# EAGLE schematic ESP8266MDL (EAGLE 7.7.0)
3v3 to TTL interfaceboard for HC-04/05/06 bluetoothmodule Dipswitch is provided for manual setting AT-mode to programming module Powersupply led and State led are added for easy monitoring
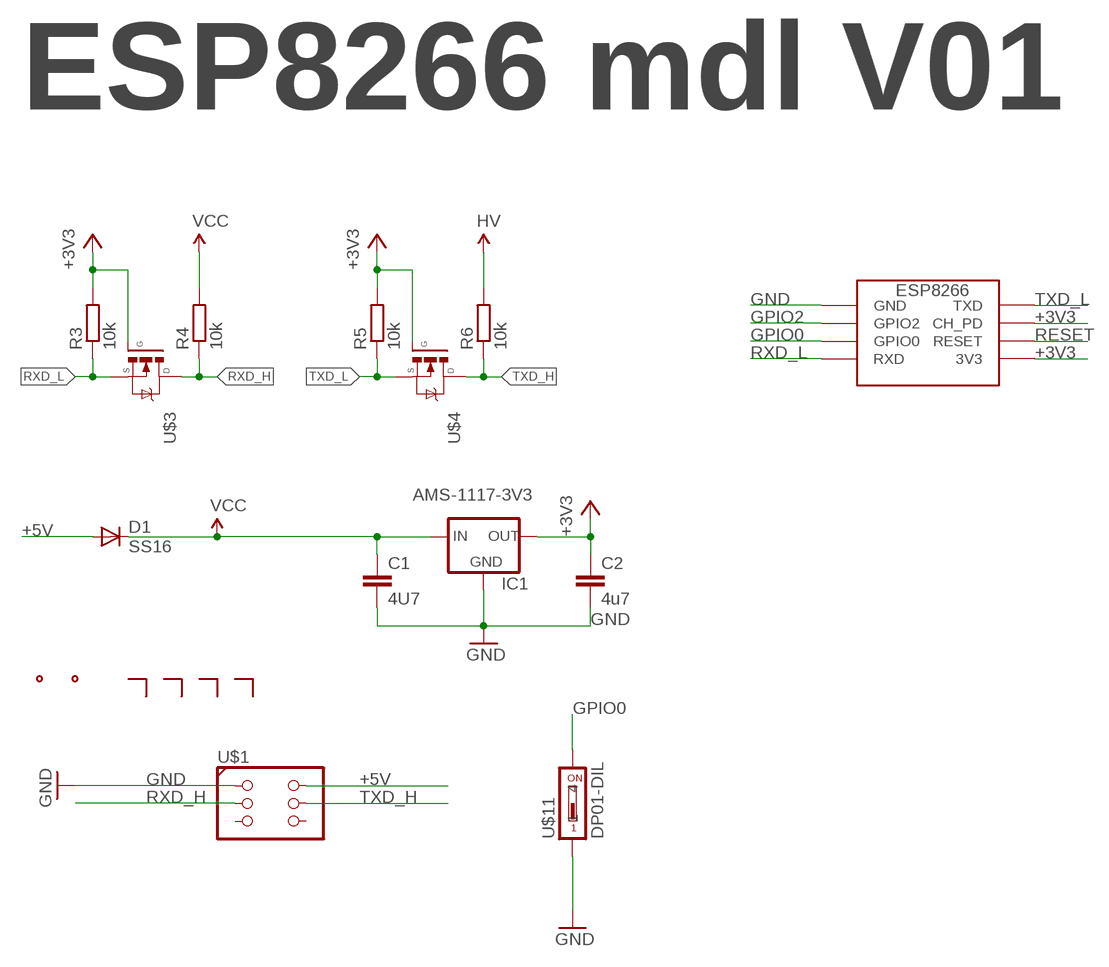
[diagram p0: schematic, sheet 1]

## Parts
C1  4U7  C-EUC0805  [C0805]
C2  4u7  C-EUC0805  [C0805]
D1  SS16  DIODE-DO214AC  [DO214AC]
IC1  AMS-1117-3V3  LM1117  [SOT223]
R3  10k  R-EU_R0805  [R0805]
R4  10k  R-EU_R0805  [R0805]
R5  10k  R-EU_R0805  [R0805]
R6  10k  R-EU_R0805  [R0805]
U$1  PINHD-2X3S  [2X03S]
U$2  MARKER  [MARKER]
U$3  2N7002-S  [SOT23-FET-SMALL]
U$4  2N7002-S  [SOT23-FET-SMALL]
U$5  MARKER  [MARKER]
U$6  MARKERDUAL-50  [MARKER50]
U$7  ESP8266  [ESP8266]
U$8  MARKER  [MARKER]
U$9  MARKER  [MARKER]
U$11  DP01-DIL  [DP-01]

## Nets
+3V3: C2.1 IC1.2(OUT) IC1.4(OUT) R3.2 R5.2 U$3.G U$4.G U$7.P$4(CH_PD) U$7.P$8(3V3)
+5V: D1.A U$1.2
GND: C1.2 C2.2 IC1.1(GND) U$1.1 U$7.P$1(GND) U$11.P$1
GPIO0: U$7.P$5(GPIO0) U$11.P$2
GPIO2: U$7.P$3(GPIO2)
RESET: U$7.P$6(RESET)
RXD_H: R4.1 U$1.3 U$3.D
RXD_L: R3.1 U$3.S U$7.P$7(RXD)
TXD_H: R6.1 U$1.4 U$4.D
TXD_L: R5.1 U$4.S U$7.P$2(TXD)
VCC: C1.1 D1.C IC1.3(IN) R4.2 R6.2 ; supply symbol labelled HV
Unconnected: U$1.5 U$1.6

## Notes on the sheet
- ESP8266 mdl V01

## Library data of the parts
C1 C2 = rcl:C-EU: CAPACITOR, European symbol
D1 = MyLib:DIODE: DIODE Diode
IC1 = v-reg-3:LM1117
R3-R6 = rcl:R-EU_: RESISTOR, European symbol
U$1 = MyLib:PINHD-2X3
U$2 U$5 U$8 U$9 = MyLib:MARKER: Marker pad without connections
U$3 U$4 = MyLib:2N7002: 2N7002 N-FET HEX SOT-23
U$6 = MyLib:MARKERDUAL: Marker for Duallayer boards
U$7 = MyLib:ESP8266
U$11 = MyLib:DP01